# Altium schematic sheet core.SchDoc
size A4
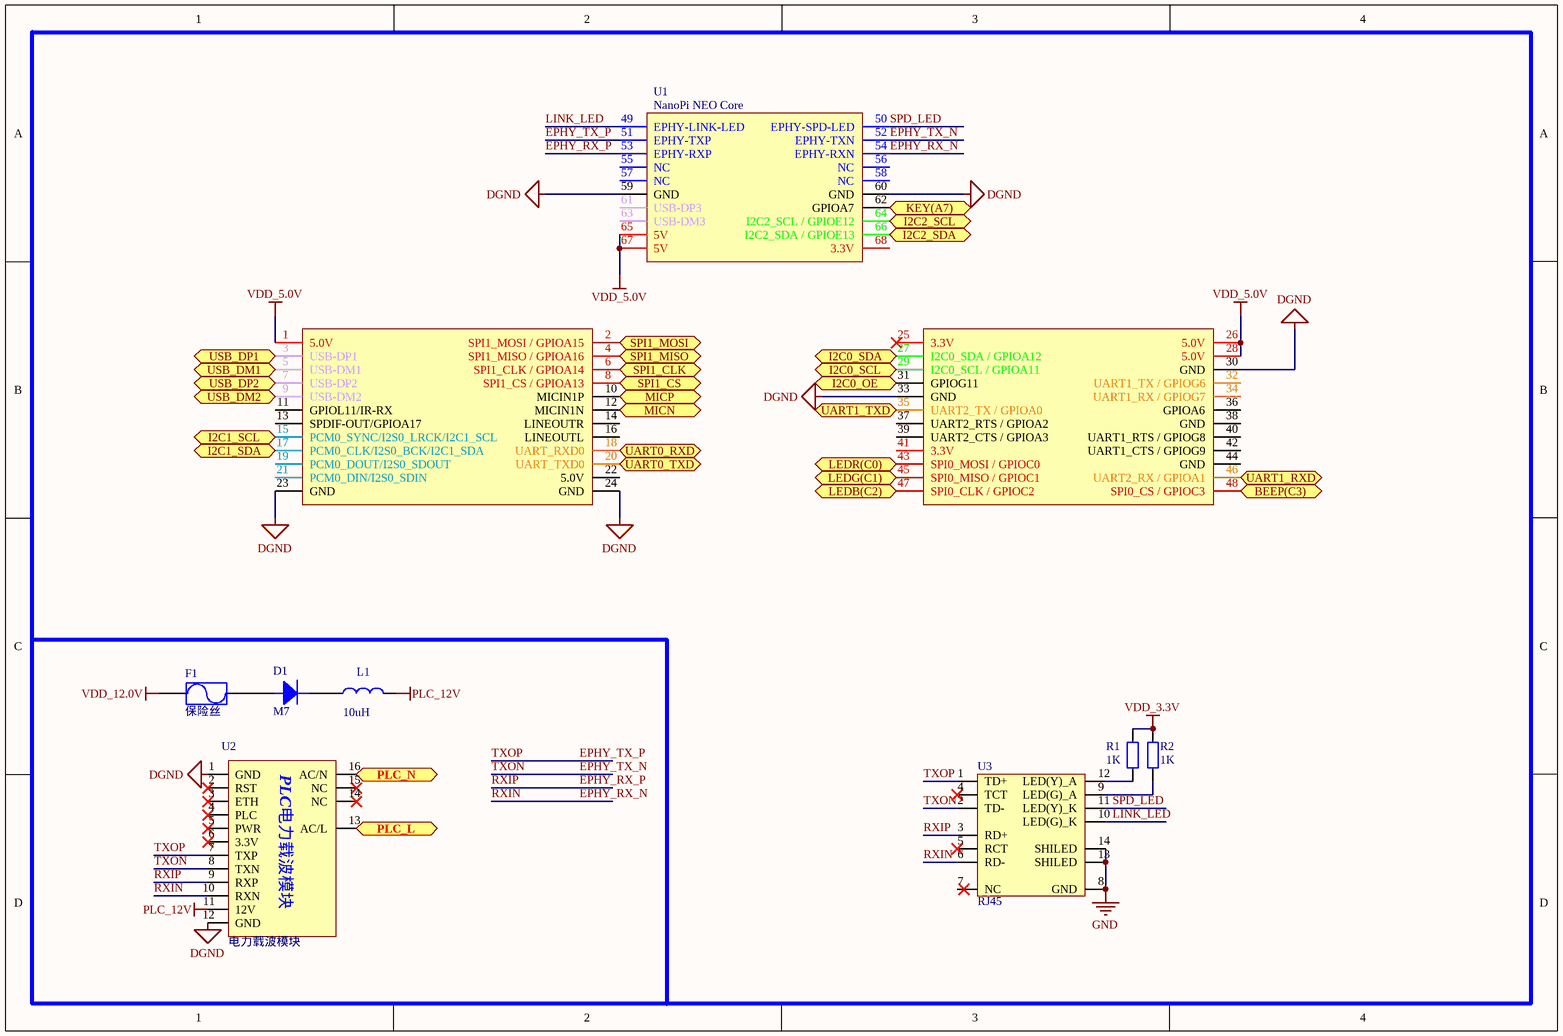
[diagram p0: core.SchDoc]

## Parts
D1  M7  [SMA/DO-214AC]
F1  保险丝  [1812]
L1  10uH  [1206L]
R1  1K  [0805R]
R2  1K  [0805R]
U1  NanoPi NEO Core  [NanoPi NEO Core]
U2  电力载波模块  [电力载波模块6410]
U3  RJ45  [RJ45]

## Ports
BEEP(C3), I2C0_OE, I2C0_SCL, I2C0_SDA, I2C1_SCL, I2C1_SDA, I2C2_SCL, I2C2_SDA, KEY(A7), LEDB(C2), LEDG(C1), LEDR(C0), MICN, MICP, PLC_L, PLC_N, SPI1_CLK, SPI1_CS, SPI1_MISO, SPI1_MOSI, UART0_RXD, UART0_TXD, UART1_RXD, UART1_TXD, USB_DM1, USB_DM2, USB_DP1, USB_DP2

## Nets
DGND: U1.23(GND) U1.24(GND) U1.30(GND) U1.33(GND) U1.59(GND) U1.60(GND) U2.1(GND) U2.12(GND)
GND: U3.8(GND) U3.13(SHILED) U3.14(SHILED)
PLC_12V: L1.2 U2.11(12V)
VDD_3.3V: R1.1 R2.1
VDD_5.0V: U1.1(5.0V) U1.26(5.0V) U1.28(5.0V) U1.65(5V) U1.67(5V)
VDD_12.0V: F1.1
BEEP(C3): U1.48(SPI0_CS_/_GPIOC3) ; port BEEP(C3)
EPHY_RX_N: U1.54(EPHY-RXN) U2.10(RXN) U3.6(RD-)  [also labelled RXIN]
EPHY_RX_P: U1.53(EPHY-RXP) U2.9(RXP) U3.3(RD+)  [also labelled RXIP]
EPHY_TX_N: U1.52(EPHY-TXN) U2.8(TXN) U3.2(TD-)  [also labelled TXON]
EPHY_TX_P: U1.51(EPHY-TXP) U2.7(TXP) U3.1(TD+)  [also labelled TXOP]
I2C0_OE: U1.31(GPIOG11) ; port I2C0_OE
I2C0_SCL: U1.29(I2C0_SCL_/_GPIOA11) ; port I2C0_SCL
I2C0_SDA: U1.27(I2C0_SDA_/_GPIOA12) ; port I2C0_SDA
I2C1_SCL: U1.15(PCM0_SYNC/I2S0_LRCK/I2C1_SCL) ; port I2C1_SCL
I2C1_SDA: U1.17(PCM0_CLK/I2S0_BCK/I2C1_SDA) ; port I2C1_SDA
I2C2_SCL: U1.64(I2C2_SCL_/_GPIOE12) ; port I2C2_SCL
I2C2_SDA: U1.66(I2C2_SDA_/_GPIOE13) ; port I2C2_SDA
KEY(A7): U1.62(GPIOA7) ; port KEY(A7)
LEDB(C2): U1.47(SPI0_CLK_/_GPIOC2) ; port LEDB(C2)
LEDG(C1): U1.45(SPI0_MISO_/_GPIOC1) ; port LEDG(C1)
LEDR(C0): U1.43(SPI0_MOSI_/_GPIOC0) ; port LEDR(C0)
LINK_LED: U1.49(EPHY-LINK-LED) U3.10(LED(G)_K)
MICN: U1.12(MICIN1N) ; port MICN
MICP: U1.10(MICIN1P) ; port MICP
PLC_L: U2.13(AC/L) ; port PLC_L
PLC_N: U2.16(AC/N) ; port PLC_N
SPD_LED: U1.50(EPHY-SPD-LED) U3.11(LED(Y)_K)
SPI1_CLK: U1.6(SPI1_CLK_/_GPIOA14) ; port SPI1_CLK
SPI1_CS: U1.8(SPI1_CS_/_GPIOA13) ; port SPI1_CS
SPI1_MISO: U1.4(SPI1_MISO_/_GPIOA16) ; port SPI1_MISO
SPI1_MOSI: U1.2(SPI1_MOSI_/_GPIOA15) ; port SPI1_MOSI
UART0_RXD: U1.18(UART_RXD0) ; port UART0_RXD
UART0_TXD: U1.20(UART_TXD0) ; port UART0_TXD
UART1_RXD: U1.46(UART2_RX_/_GPIOA1) ; port UART1_RXD
UART1_TXD: U1.35(UART2_TX_/_GPIOA0) ; port UART1_TXD
USB_DM1: U1.5(USB-DM1) ; port USB_DM1
USB_DM2: U1.9(USB-DM2) ; port USB_DM2
USB_DP1: U1.3(USB-DP1) ; port USB_DP1
USB_DP2: U1.7(USB-DP2) ; port USB_DP2
NetD1_1: D1.1 F1.2
NetD1_2: D1.2 L1.1
NetR1_2: R1.2 U3.12(LED(Y)_A)
NetR2_2: R2.2 U3.9(LED(G)_A)

Not connected (* = marked no-connect by the designer): U1 11(GPIOL11/IR-RX) 13(SPDIF-OUT/GPIOA17) 14(LINEOUTR) 16(LINEOUTL) 19(PCM0_DOUT/I2S0_SDOUT) 21(PCM0_DIN/I2S0_SDIN) 22(5.0V) 25(3.3V)* 32(UART1_TX_/_GPIOG6) 34(UART1_RX_/_GPIOG7) 36(GPIOA6) 37(UART2_RTS_/_GPIOA2) 38(GND) 39(UART2_CTS_/_GPIOA3) 40(UART1_RTS_/_GPIOG8) 41(3.3V) 42(UART1_CTS_/_GPIOG9) 44(GND) 55(NC) 56(NC) 57(NC) 58(NC) 61(USB-DP3) 63(USB-DM3) 68(3.3V); U2 2(RST)* 3(ETH)* 4(PLC)* 5(PWR)* 6(3.3V)* 14(NC)* 15(NC)*; U3 4(TCT)* 5(RCT)* 7(NC)

## Notes on the sheet
- (in symbol 电力载波模块6410) PLC电力载波模块

## Library data of the parts
D1 = Diode: 二极管
F1 = Fuse
L1 = L: 电感
R1 R2 = Res: 电阻
U2 = 电力载波模块6410